# EAGLE design leakage (EAGLE 9.2.2)
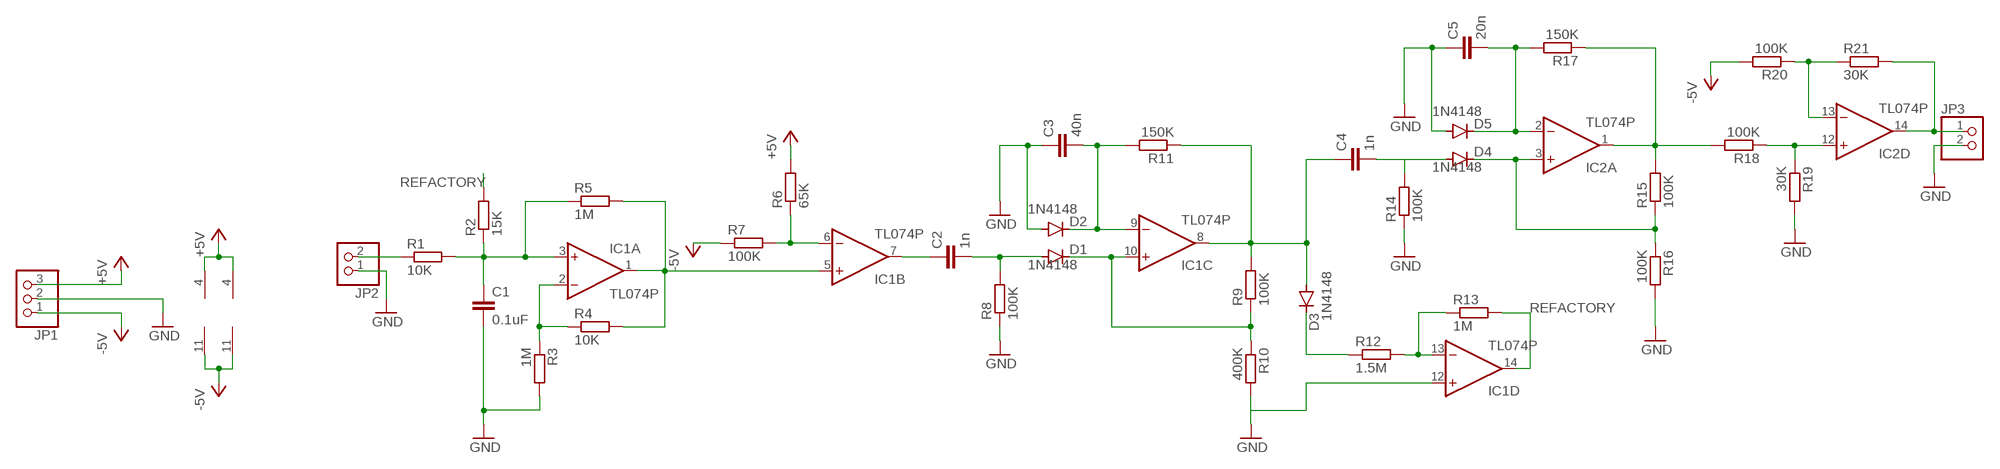
[diagram p0: schematic, sheet 1]

## Parts
C1  0.1uF  C-EU025-025X050  [C025-025X050]
C2  1n  C-EU025-025X050  [C025-025X050]
C3  40n  C-EU025-025X050  [C025-025X050]
C4  1n  C-EU025-025X050  [C025-025X050]
C5  20n  C-EU025-025X050  [C025-025X050]
D1  1N4148  1N4148DO35-10  [DO35-10]
D2  1N4148  1N4148DO35-10  [DO35-10]
D3  1N4148  1N4148DO35-10  [DO35-10]
D4  1N4148  1N4148DO35-10  [DO35-10]
D5  1N4148  1N4148DO35-10  [DO35-10]
IC1  TL074P  [DIL14]
IC2  TL074P  [DIL14]
JP1  PINHD-1X3  [1X03]
JP2  PINHD-1X2  [1X02]
JP3  PINHD-1X2  [1X02]
R1  10K  R-EU_0207/10  [0207/10]
R2  15K  R-EU_0207/10  [0207/10]
R3  1M  R-EU_0207/10  [0207/10]
R4  10K  R-EU_0207/10  [0207/10]
R5  1M  R-EU_0207/10  [0207/10]
R6  65K  R-EU_0207/10  [0207/10]
R7  100K  R-EU_0207/10  [0207/10]
R8  100K  R-EU_0207/10  [0207/10]
R9  100K  R-EU_0207/10  [0207/10]
R10  400K  R-EU_0207/10  [0207/10]
R11  150K  R-EU_0207/10  [0207/10]
R12  1.5M  R-EU_0207/10  [0207/10]
R13  1M  R-EU_0207/10  [0207/10]
R14  100K  R-EU_0207/10  [0207/10]
R15  100K  R-EU_0207/10  [0207/10]
R16  100K  R-EU_0207/10  [0207/10]
R17  150K  R-EU_0207/10  [0207/10]
R18  100K  R-EU_0207/10  [0207/10]
R19  30K  R-EU_0207/10  [0207/10]
R20  100K  R-EU_0207/10  [0207/10]
R21  30K  R-EU_0207/10  [0207/10]

## Nets
+5V [power]: IC1.4(P:V+) IC2.4(P:V+) JP1.3 R6.2
-5V [power]: IC1.11(P:V-) IC2.11(P:V-) JP1.1 R7.1 R20.2
GND [power]: C1.2 C3.1 C5.1 D2.A D5.A IC1.12(D:+IN) JP1.2 JP2.1 JP3.2 R3.2 R8.1 R10.2 R14.1 R16.2 R19.2
N$1: C1.1 IC1.3(A:+IN) R1.2 R2.1 R5.1
N$2: IC1.2(A:-IN) R3.1 R4.1
N$3: IC1.1(A:OUT) IC1.5(B:+IN) R4.2 R5.2
N$4: JP2.2 R1.1
N$5: IC1.6(B:-IN) R6.1 R7.2
N$6: C2.1 IC1.7(B:OUT)
N$7: C2.2 D1.A R8.2
N$8: D1.C IC1.10(C:+IN) R9.1 R10.1
N$10: C4.1 D3.A IC1.8(C:OUT) R9.2 R11.1
N$11: C3.2 D2.C IC1.9(C:-IN) R11.2
N$12: IC1.13(D:-IN) R12.2 R13.1
N$13: D3.C R12.1
N$14: IC2.12(D:+IN) R18.1 R19.1
N$15: C4.2 D4.A R14.2
N$16: D4.C IC2.3(A:+IN) R15.1 R16.1
N$17: IC2.1(A:OUT) R15.2 R17.1 R18.2
N$18: C5.2 D5.C IC2.2(A:-IN) R17.2
N$20: IC2.13(D:-IN) R20.1 R21.1
N$21: IC2.14(D:OUT) JP3.1 R21.2
REFACTORY: IC1.14(D:OUT) R2.2 R13.2
Unconnected: IC2.5(B:+IN) IC2.6(B:-IN) IC2.7(B:OUT) IC2.8(C:OUT) IC2.9(C:-IN) IC2.10(C:+IN)

## Library data of the parts
C1-C5 = rcl:C-EU: CAPACITOR, European symbol; SPICEPREFIX: C
D1-D5 = diode:1N4148: DIODE high speed (Philips)
IC1 IC2 = linear:TL074: OP AMP
JP1 = pinhead:PINHD-1X3: PIN HEADER
JP2 JP3 = pinhead:PINHD-1X2: PIN HEADER
R1-R21 = rcl:R-EU_: RESISTOR, European symbol; SPICEPREFIX: R

## Net classes
0 signal: width 0.3 mm, drill 0.5 mm, clearance 0.3 mm
1 power: width 0.3 mm, drill 0.5 mm, clearance 0.5 mm to class 0, clearance 0.5 mm

## Board
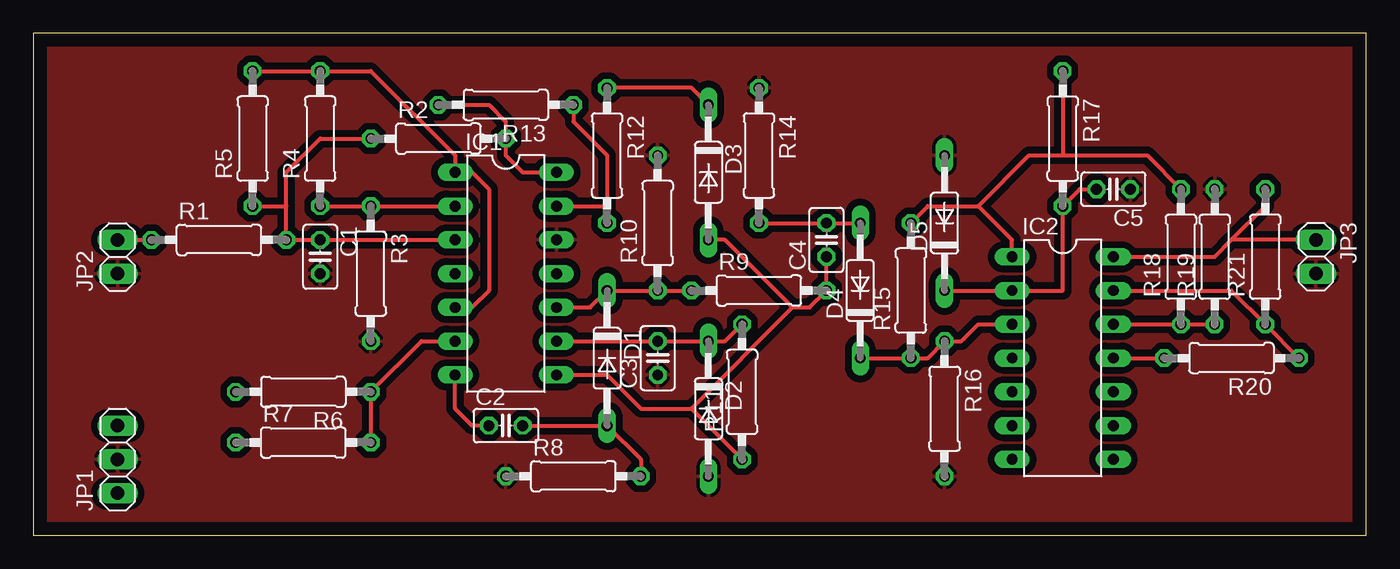
[diagram p1: board, top side]
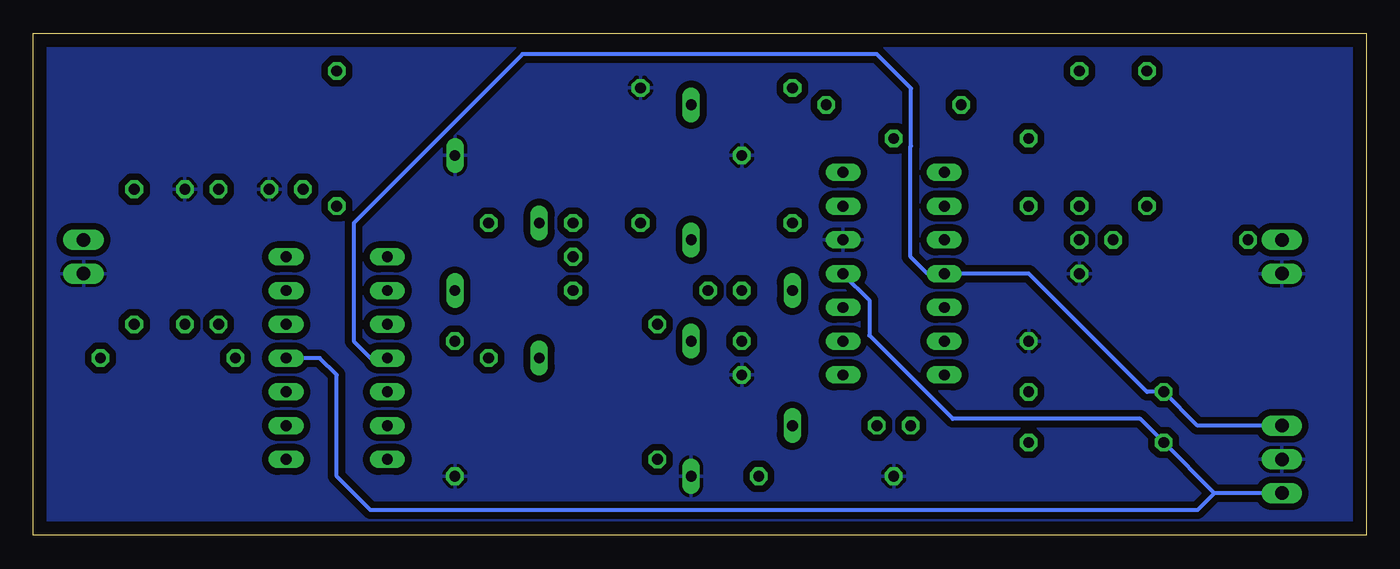
[diagram p2: board, bottom side, seen from below]

Size 100.31 x 37.77 mm. Coordinates in mm from the lower left corner, seen from the top.
Outline: 0,0 100.31,0 100.31,37.77 0,37.77 0,0
Copper layers (1*16): Top 0.035mm / dielectric 1.5mm / Bottom 0.035mm
Design rules "default": minimum track width 6mil, minimum drill 0.35mm, track to track 6mil, track to pad 6mil, pad to pad 6mil, via to via 6mil, smd to smd 6mil, copper to edge 40mil, drill to drill 6mil, minimum pad ring 10mil, minimum via ring 8mil, stop-mask expansion 4mil, vias tented up to drill 0mil, thermal gap 10mil

### Footprints (pad centres in the part's own frame; a part is rotated, then mirrored left to right if it is on the bottom)
C025-025X050 = drill 0.813 octagon: 1 -1.27,0; 2 1.27,0
DO35-10 = drill 0.813 long: A 5.08,0; C -5.08,0
DIL14 = drill 0.813 long: 1 -7.62,-3.81; 2 -5.08,-3.81; 3 -2.54,-3.81; 4 0,-3.81; 5 2.54,-3.81; 6 5.08,-3.81; 7 7.62,-3.81; 8 7.62,3.81; 9 5.08,3.81; 10 2.54,3.81; 11 0,3.81; 12 -2.54,3.81; 13 -5.08,3.81; 14 -7.62,3.81
1X03 = drill 1.016 long: 1 -2.54,0; 2 0,0; 3 2.54,0
1X02 = drill 1.016 long: 1 -1.27,0; 2 1.27,0
0207/10 = drill 0.813 octagon: 1 -5.08,0; 2 5.08,0

### Placement (x,y rotation side)
C1  21.59,20.95 270 top
C2  35.56,8.26 0 top
C3  46.99,13.34 90 top
C4  59.69,22.23 90 top
C5  81.28,26.04 180 top
D1  43.18,13.34 270 top
D2  50.8,9.53 270 top
D3  50.8,27.3 270 top
D4  62.23,18.41 90 top
D5  68.58,23.5 90 top
IC1  35.56,19.68 270 top
IC2  77.47,13.34 270 top
JP1  6.35,5.71 90 top
JP2  6.35,20.95 90 top
JP3  96.52,20.95 270 top
R1  13.97,22.23 0 top
R2  30.48,29.84 0 top
R3  25.4,19.68 270 top
R4  21.59,29.84 90 top
R5  16.51,29.84 90 top
R6  20.32,10.79 180 top
R7  20.32,6.99 0 top
R8  40.64,4.45 0 top
R9  54.61,18.41 0 top
R10  46.99,23.5 90 top
R11  53.34,10.79 90 top
R12  43.18,28.57 270 top
R13  35.56,32.38 180 top
R14  54.61,28.57 270 top
R15  66.04,18.41 90 top
R16  68.58,9.53 270 top
R17  77.47,29.84 270 top
R18  86.36,20.95 90 top
R19  88.9,20.95 90 top
R20  90.17,13.34 180 top
R21  92.71,20.95 90 top

### Tracks (layer width: path | path; a pad name or v marks a point on that pad's centre or on a via)
+5V
  Bottom 0.3: JP1.3 12.7,8.26 R6.2 16.51,10.79 25.4,19.68 IC1.4 33.02,19.68 34.29,20.95 34.29,29.26 34.25,29.3 34.25,33.62 36.83,36.2 63.5,36.2 76.2,23.5 76.2,14.61 74.93,13.34 IC2.4
-5V
  Top 0.3: IC2.11 R20.2
  Bottom 0.3: JP1.1 11.43,3.17 | 11.43,3.17 R7.1 17.02,8.76 31.11,8.76 37.4,15.05 37.4,17.69 39.37,19.66 IC1.11 | IC2.11 78.74,13.34 77.47,12.06 77.47,4.45 74.93,1.91 12.7,1.91 11.43,3.17
GND
  pour Top: -3.81,-1.27 -3.81,50.8 5.08,59.69 85.09,59.69 86.36,58.42 113.03,31.75 113.03,8.89 95.25,-8.89 -3.81,-8.89
  pour Bottom: -6.35,-15.24 -6.35,49.53 7.62,63.5 77.47,63.5 107.95,33.02 107.95,-1.27 93.98,-15.24
N$1
  Top 0.3: 19.05,24.77 R1.2 C1.1 IC1.3 | 19.05,24.77 19.05,27.3 21.59,29.84 R2.1 | R5.1 19.05,24.77
N$2
  Top 0.3: IC1.2 R3.1 R4.1
N$3
  Top 0.3: R5.2 R4.2 25.4,34.92 31.75,28.57 IC1.1 33.02,27.3 34.29,26.04 34.29,18.41 33.02,17.14 IC1.5
N$4
  Top 0.3: JP2.2 R1.1
N$5
  Top 0.3: R7.2 R6.1 29.21,14.61 IC1.6
N$6
  Top 0.3: C2.1 33.02,8.26 31.75,9.53 IC1.7
N$7
  Top 0.3: C2.2 D1.A 45.72,5.71 R8.2
N$8
  Top 0.3: IC1.10 41.91,17.14 D1.C R10.1 R9.1
N$10
  Top 0.3: IC1.8 43.18,12.06 45.72,9.53 49.53,9.53 | 49.53,9.53 57.15,17.14 | 57.15,17.14 58.42,17.14 R9.2 C4.1 | 49.53,9.53 R11.1 | 57.15,17.14 52.07,22.23 D3.A
N$11
  Top 0.3: IC1.9 C3.2 D2.C 52.07,14.61 R11.2
N$12
  Top 0.3: R13.1 40.64,31.11 43.18,28.57 43.18,24.77 | 43.18,24.77 R12.2 | IC1.13 43.18,24.77
N$13
  Top 0.3: D3.C 49.53,33.66 R12.1
N$14
  Top 0.3: IC2.12 R18.1 R19.1
N$15
  Top 0.3: R14.2 C4.2 D4.A
N$16
  Top 0.3: D4.C R15.1 67.31,13.34 R16.1 69.85,14.61 71.12,15.88 IC2.3
N$17
  Top 0.3: R15.2 67.31,24.77 71.12,24.77 | 71.12,24.77 74.93,28.57 77.47,28.57 | 77.47,28.57 83.82,28.57 R18.2 | R17.1 77.47,28.57 | IC2.1 73.66,22.23 71.12,24.77
N$18
  Top 0.3: D5.C IC2.2 77.47,18.41 R17.2 78.74,26.04 C5.2
N$20
  Top 0.3: IC2.13 90.17,18.41 R21.1 R20.1
N$21
  Top 0.3: IC2.14 88.9,20.95 90.17,22.23 | 90.17,22.23 92.71,24.77 R21.2 | JP3.1 90.17,22.23
REFACTORY
  Top 0.3: IC1.14 36.83,27.3 35.56,28.57 R2.2 35.56,31.11 34.29,32.38 R13.2